# EAGLE design adapter_v1.2 (EAGLE 9.3.2)
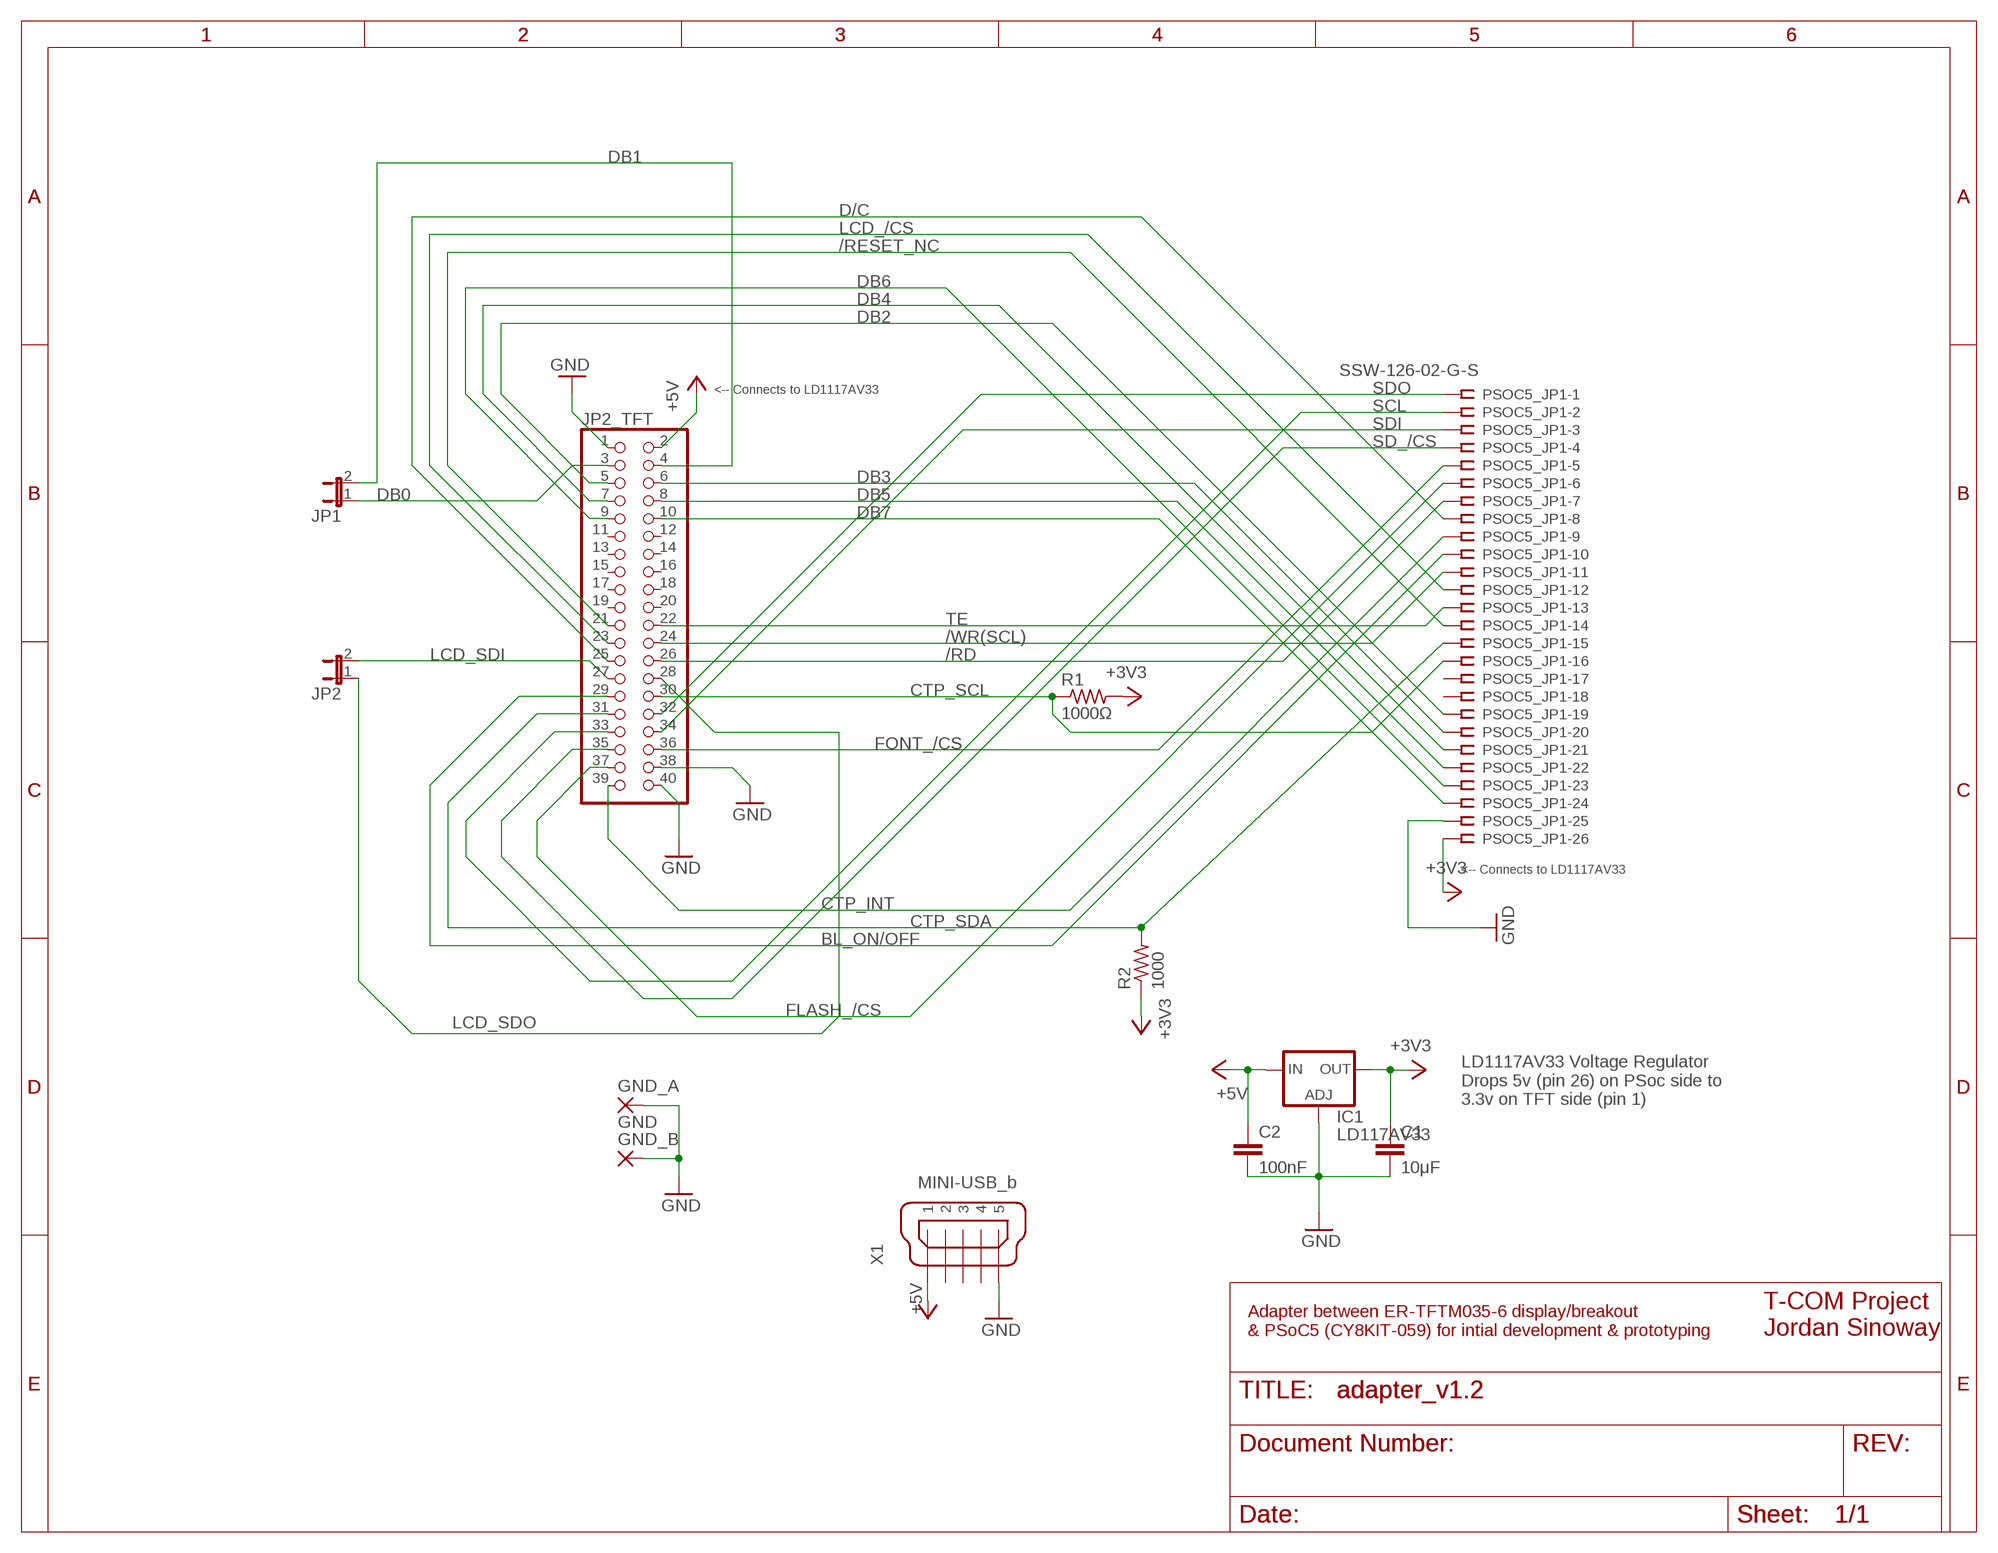
[diagram p0: schematic, sheet 1]

## Parts
C1  10μF  C2.5/2  [C2.5-2]
C2  100nF  C2.5/2  [C2.5-2]
GND_A  GND  SMD5  [SMD2,54-5,08]
GND_B  SMD5  [SMD2,54-5,08]
IC1  LD117AV33  [TO220L1]
JP1  JP1E  [JP1]
JP2  JP1E  [JP1]
JP2_TFT  PINHD-2X20  [2X20]
PSOC5_JP1  SSW-126-02-G-S  [SSW-126-02-G-S]
R1  1000Ω  R-US_0204/7  [0204/7]
R2  1000  R-US_0204/7  [0204/7]
X1  MINI-USB_b  MINI-USB_SHIELD5P2-32005-601  [32005-601]

## Nets
+3V3 [GND/voltage]: C1.1 IC1.2(OUT) PSOC5_JP1.26 R1.2 R2.1
+5V [GND/voltage]: C2.1 IC1.3(IN) JP2_TFT.2 X1.1
/RD: JP2_TFT.26 PSOC5_JP1.7
/RESET_NC: JP2_TFT.21 PSOC5_JP1.14
/WR(SCL): JP2_TFT.24 PSOC5_JP1.11
BL_ON/OFF: JP2_TFT.29 PSOC5_JP1.10
CTP_INT: JP2_TFT.39 PSOC5_JP1.9
CTP_SCL: JP2_TFT.30 PSOC5_JP1.16 R1.1
CTP_SDA: JP2_TFT.31 PSOC5_JP1.15 R2.2
D/C: JP2_TFT.25 PSOC5_JP1.8
DB0: JP1.1 JP2_TFT.3
DB1: JP1.2 JP2_TFT.4
DB2: JP2_TFT.5 PSOC5_JP1.19
DB3: JP2_TFT.6 PSOC5_JP1.20
DB4: JP2_TFT.7 PSOC5_JP1.21
DB5: JP2_TFT.8 PSOC5_JP1.22
DB6: JP2_TFT.9 PSOC5_JP1.23
DB7: JP2_TFT.10 PSOC5_JP1.24
FLASH_/CS: JP2_TFT.37 PSOC5_JP1.6
FONT_/CS: JP2_TFT.36 PSOC5_JP1.5
GND [GND/voltage]: C1.2 C2.2 GND_A.1(P) GND_B.1(P) IC1.1(ADJ) JP2_TFT.1 JP2_TFT.38 JP2_TFT.40 PSOC5_JP1.25 X1.5
LCD_/CS: JP2_TFT.23 PSOC5_JP1.12
LCD_SDI: JP2.2 JP2_TFT.27
LCD_SDO: JP2.1 JP2_TFT.28
SCL: JP2_TFT.33 PSOC5_JP1.2
SD_/CS: JP2_TFT.35 PSOC5_JP1.4
SDI: JP2_TFT.34 PSOC5_JP1.3
SDO: JP2_TFT.32 PSOC5_JP1.1
TE: JP2_TFT.22 PSOC5_JP1.13
Unconnected: JP2_TFT.11 JP2_TFT.12 JP2_TFT.13 JP2_TFT.14 JP2_TFT.15 JP2_TFT.16 JP2_TFT.17 JP2_TFT.18 JP2_TFT.19 JP2_TFT.20 PSOC5_JP1.17 PSOC5_JP1.18 X1.2 X1.3 X1.4 X1.M1(S1) X1.M2(S2)

## Notes on the sheet
- <-- Connects to LD1117AV33
- <-- Connects to LD1117AV33
- LD1117AV33 Voltage Regulator
  Drops 5v (pin 26) on PSoc side to
  3.3v on TFT side (pin 1)
- Adapter between ER-TFTM035-6 display/breakout 
  & PSoC5 (CY8KIT-059) for intial development & prototyping
- T-COM Project
  Jordan Sinoway

## Library data of the parts
C1 C2 = capacitor-wima:C: CAPACITOR naming: grid - package width
GND_A GND_B = wirepad:SMD5: SMD PAD
IC1 = v-reg:LD117A?*: Low drop fixed and adjustable positive voltage regulators 1 A Source: http://www.st.com/stonline/products/literature/ds/7194/ld1117axx.pdf
JP1 JP2 = jumper:JP1E: JUMPER
JP2_TFT = pinhead:PINHD-2X20: PIN HEADER
PSOC5_JP1 = con-samtec:SSW-126-02-G-S: THROUGH-HOLE .025" SQ POST SOCKET Source: Samtec SSW.pdf; MF: Samtec Inc.; MPN: SSW-126-02-G-S; OC_FARNELL: unknown; OC_NEWARK: 11P9742
R1 R2 = rcl:R-US_: RESISTOR, American symbol; SPICEPREFIX: R
X1 = con-cypressindustries:MINI-USB_SHIELD5P2-: MINI USB-B R/A DIP 5pol. Source: www.cypressindustries.com; OC_FARNELL: unknown; OC_NEWARK: unknown

## Net classes
0 default: clearance 0.102 mm
1 GND/voltage: width 0.457 mm, drill 0.152 mm, clearance 0.152 mm

## Board
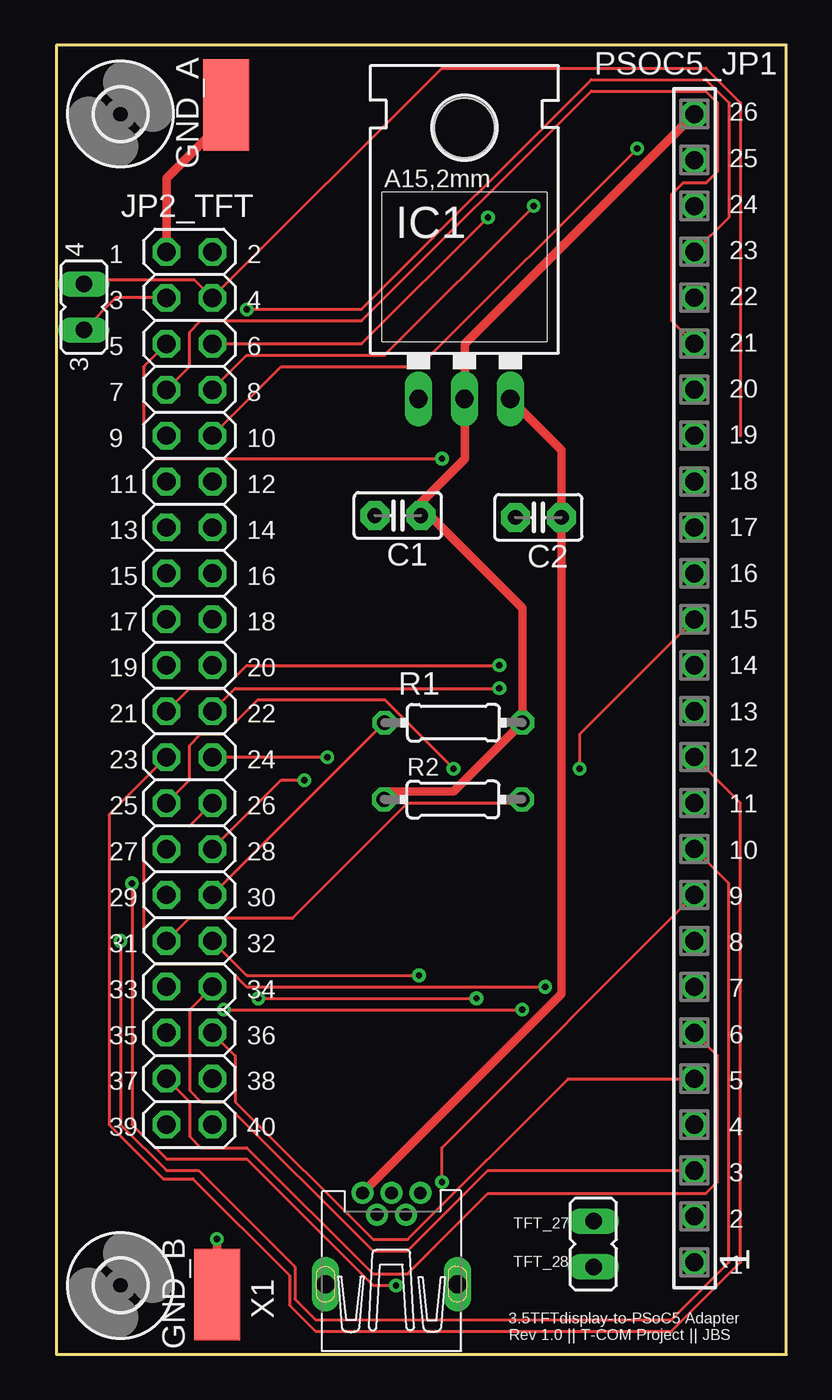
[diagram p1: board, top side]
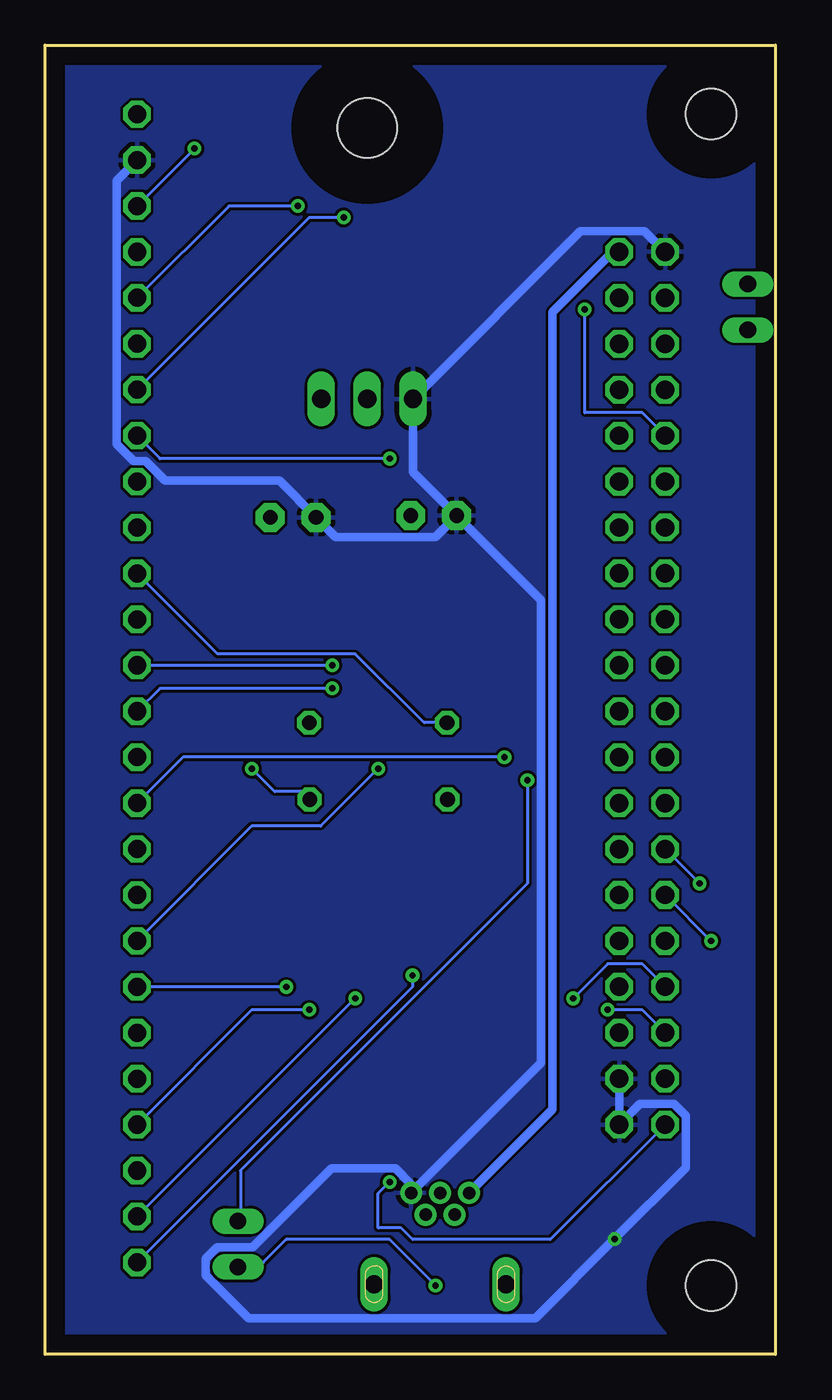
[diagram p2: board, bottom side, seen from below]

Size 40.39 x 72.39 mm. Coordinates in mm from the lower left corner, seen from the top.
Outline: 0,0 40.39,0 40.39,72.39 0,72.39 0,0
Copper layers (1*16): Top 0.035mm / dielectric 1.5mm / Bottom 0.035mm
Design rules "default": minimum track width 6mil, minimum drill 0.35mm, track to track 6mil, track to pad 6mil, pad to pad 6mil, via to via 6mil, smd to smd 6mil, copper to edge 40mil, drill to drill 6mil, minimum pad ring 10mil, minimum via ring 8mil, stop-mask expansion 4mil, vias tented up to drill 0mil, thermal gap 10mil

### Footprints (pad centres in the part's own frame; a part is rotated, then mirrored left to right if it is on the bottom)
C2.5-2 = drill 0.813 pad 1.6 octagon: 1 -1.27,0; 2 1.27,0
SMD2,54-5,08 = smd 2.54 x 5.08: 1 0,0
TO220L1 = drill 1.016 long: 1 -2.54,-3.81; 2 0,-3.81; 3 2.54,-3.81 | hole 3.302: 0,11.176
JP1 = drill 0.914 long: 1 0,-1.27; 2 0,1.27
2X20 = drill 1.016 octagon: 1 -24.13,-1.27; 2 -24.13,1.27; 3 -21.59,-1.27; 4 -21.59,1.27; 5 -19.05,-1.27; 6 -19.05,1.27; 7 -16.51,-1.27; 8 -16.51,1.27; 9 -13.97,-1.27; 10 -13.97,1.27; 11 -11.43,-1.27; 12 -11.43,1.27; 13 -8.89,-1.27; 14 -8.89,1.27; 15 -6.35,-1.27; 16 -6.35,1.27; 17 -3.81,-1.27; 18 -3.81,1.27; 19 -1.27,-1.27; 20 -1.27,1.27; 21 1.27,-1.27; 22 1.27,1.27; 23 3.81,-1.27; 24 3.81,1.27; 25 6.35,-1.27; 26 6.35,1.27; 27 8.89,-1.27; 28 8.89,1.27; 29 11.43,-1.27; 30 11.43,1.27; 31 13.97,-1.27; 32 13.97,1.27; 33 16.51,-1.27; 34 16.51,1.27; 35 19.05,-1.27; 36 19.05,1.27; 37 21.59,-1.27; 38 21.59,1.27; 39 24.13,-1.27; 40 24.13,1.27
SSW-126-02-G-S = drill 1 pad 1.5 octagon: 1 -31.75,0; 2 -29.21,0; 3 -26.67,0; 4 -24.13,0; 5 -21.59,0; 6 -19.05,0; 7 -16.51,0; 8 -13.97,0; 9 -11.43,0; 10 -8.89,0; 11 -6.35,0; 12 -3.81,0; 13 -1.27,0; 14 1.27,0; 15 3.81,0; 16 6.35,0; 17 8.89,0; 18 11.43,0; 19 13.97,0; 20 16.51,0; 21 19.05,0; 22 21.59,0; 23 24.13,0; 24 26.67,0; 25 29.21,0; 26 31.75,0
0204/7 = drill 0.813 octagon: 1 -3.81,0; 2 3.81,0
2,8 = hole 2.8: 0,0
32005-601 = drill 0.7 pad 1.016: 1 2.825,1.6; 2 1.625,0.8; 3 2.825,0; 4 1.625,-0.8; 5 2.825,-1.6 | drill 1 pad 1.422 long: M1 -2.225,3.65; M2 -2.225,-3.65

### Placement (x,y rotation side)
C1  18.9,46.38 180 top
C2  26.67,46.28 180 top
GND_A  9.4,69.09 0 top
GND_B  8.89,3.3 0 top
IC1  22.58,56.64 0 top
JP1  1.52,57.91 0 top
JP2  29.72,6.1 180 top
JP2_TFT  7.37,36.83 270 top
PSOC5_JP1  35.31,36.83 90 top
R1  21.97,34.92 0 top
R2  21.95,30.68 0 top
U$1  [2,8]  3.56,68.58 0 top
U$2  [2,8]  3.56,3.81 0 top
X1  18.54,6.1 90 top

### Tracks (layer width: path | path; a pad name or v marks a point on that pad's centre or on a via)
+3V3
  Top 0.457: R2.1 18.16,31.11 21.97,31.11 R1.2 25.78,41.27 20.7,46.35 C1.1 20.07,46.99 22.61,49.53 22.61,52.7 IC1.2 22.61,53.34 22.61,55.88 PSOC5_JP1.26
+5V
  Top 0.457: X1.1 27.94,19.92 C2.1 27.94,50.01 IC1.3
  Bottom 0.457: X1.1 12.32,13.54 12.32,57.62 8.98,60.96 JP2_TFT.2
/RD  (via drill 0.35)
  Top 0.152: v27.05,20.32 10.54,20.32 9.27,21.59 5.46,21.59 4.83,22.23 4.83,28.57 5.46,29.21 7.37,29.21 JP2_TFT.26
  Bottom 0.152: v27.05,20.32 PSOC5_JP1.7
/RESET_NC  (via drill 0.35)
  Top 0.152: v24.51,38.1 10.54,38.1 9.27,36.83 7.37,36.83 JP2_TFT.21
  Bottom 0.152: v24.51,38.1 PSOC5_JP1.14
/WR(SCL)  (via drill 0.35)
  Top 0.152: JP2_TFT.24 v14.99,33.02
  Bottom 0.152: PSOC5_JP1.11 32.77,33.02 v14.99,33.02
BL_ON/OFF  (via drill 0.35)
  Top 0.152: PSOC5_JP1.10 37.21,26.04 37.21,5.08 34.04,1.9 14.35,1.9 13.21,3.05 13.21,4.83 7.87,10.16 6.1,10.16 3.56,12.7 v3.56,22.86
  Bottom 0.152: JP2_TFT.29 v3.56,22.86
CTP_INT  (via drill 0.35)
  Top 0.152: PSOC5_JP1.9 21.34,11.43 v21.34,9.53
  Bottom 0.152: v21.34,9.53 21.97,8.89 21.97,6.99 20.7,6.99 20.07,6.35 12.45,6.35 JP2_TFT.39
CTP_SCL
  Top 0.152: JP2_TFT.30 R1.1
  Bottom 0.152: PSOC5_JP1.16 30.86,38.73 23.24,38.73 19.43,34.92 R1.1
CTP_SDA  (via drill 0.35)
  Top 0.152: JP2_TFT.31 7.37,24.13 13.08,24.13 19.43,30.48 25.15,30.48 R2.2 | PSOC5_JP1.15 28.96,34.29 v28.96,32.38
  Bottom 0.152: v28.96,32.38 27.69,31.11 25.78,31.11 R2.2
D/C  (via drill 0.35)
  Top 0.152: v21.97,32.38 18.16,36.2 11.18,36.2 9.27,34.29 8,34.29 7.37,33.65 7.37,31.75 JP2_TFT.25
  Bottom 0.152: PSOC5_JP1.8 28.96,29.21 25.15,29.21 v21.97,32.38
DB0
  Top 0.152: JP2_TFT.3 3.3,58.42 JP1.1
DB1
  Top 0.152: 37.85,50.8 37.85,69.22 35.94,71.12 21.34,71.12 JP2_TFT.4 7.64,59.41 1.75,59.41 JP1.2
DB2  (via drill 0.35)
  Top 0.152: v21.34,49.53 5.46,49.53 4.83,50.16 4.83,54.61 JP2_TFT.5
  Bottom 0.152: PSOC5_JP1.19 34.04,49.53 v21.34,49.53
DB3  (via drill 0.35)
  Top 0.152: v23.88,62.87 16.89,55.88 JP2_TFT.6
  Bottom 0.152: PSOC5_JP1.20 25.78,62.87 v23.88,62.87
DB4
  Top 0.152: PSOC5_JP1.21 34.04,57.15 34.04,64.14 34.67,64.77 35.94,64.77 36.58,65.41 36.58,69.22 35.94,69.85 29.59,69.85 16.89,57.15 8,57.15 7.37,56.51 7.37,54.61 JP2_TFT.7
DB5  (via drill 0.35)
  Top 0.152: v26.42,63.5 18.16,55.24 10.54,55.24 JP2_TFT.8
  Bottom 0.152: PSOC5_JP1.22 30.23,63.5 v26.42,63.5
DB6  (via drill 0.35)
  Top 0.152: PSOC5_JP1.23 37.21,62.87 37.21,69.22 35.94,70.48 29.59,70.48 16.89,57.78 v10.54,57.78
  Bottom 0.152: v10.54,57.78 10.54,52.07 7.37,52.07 JP2_TFT.9
DB7  (via drill 0.35)
  Top 0.152: v32.13,66.67 20.07,54.61 12.45,54.61 JP2_TFT.10
  Bottom 0.152: v32.13,66.67 PSOC5_JP1.24
FLASH_/CS
  Top 0.152: PSOC5_JP1.6 36.58,16.51 36.58,9.53 35.94,8.89 23.88,8.89 19.43,4.45 17.53,4.45 10.54,11.43 8,11.43 7.37,12.07 7.37,13.97 JP2_TFT.37
FONT_/CS
  Top 0.152: PSOC5_JP1.5 28.32,15.24 19.43,6.35 17.53,6.35 9.91,13.97 9.91,16.51 JP2_TFT.36
GND  (via drill 0.35)
  Top 0.457: GND_A.1 9.4,68.33 6.1,65.02 JP2_TFT.1 | GND_B.1 v8.89,6.37
  Bottom 0.457: C1.2 20.04,48.79 IC1.1 10.77,62.1 7.24,62.1 JP2_TFT.1 | JP2_TFT.38 JP2_TFT.40 7.49,13.84 5.62,13.84 4.95,13.17 4.95,10.31 v8.89,6.37 13.28,1.98 29.13,1.98 31.52,4.37 31.52,5.28 30.88,5.92 28.91,5.92 24.54,10.28 21.02,10.28 20.14,9.41 X1.5 12.96,16.11 12.96,41.71 C1.2 | C1.2 18.81,45.2 24.32,45.2 C2.2 27.43,48.3 33.75,48.3 34.84,49.39 35.51,49.39 36.44,50.33 36.44,64.91 PSOC5_JP1.25
  pour Bottom: 46.74,77.47 46.74,-3.81 -5.33,-3.81 -5.33,77.47
LCD_/CS
  Top 0.152: PSOC5_JP1.12 37.85,30.48 37.85,5.08 34.04,1.27 14.35,1.27 12.9,2.72 12.9,4.37 7.56,9.72 5.91,9.72 2.92,12.7 2.92,29.84 JP2_TFT.23
LCD_SDI  (via drill 0.35)
  Top 0.152: v18.8,3.81 17.53,3.81 10.54,10.79 6.1,10.79 4.19,12.7 v4.19,26.04
  Bottom 0.152: v18.8,3.81 21.34,6.35 27.05,6.35 28.32,5.08 29.59,5.08 JP2.2 | JP2_TFT.27 v4.19,26.04
LCD_SDO  (via drill 0.35)
  Top 0.152: v13.72,31.75 12.45,31.75 JP2_TFT.28
  Bottom 0.152: v13.72,31.75 13.72,26.04 29.59,10.16 29.59,7.62 JP2.1
SCL  (via drill 0.35)
  Top 0.152: v11.18,19.68 v23.24,19.68
  Bottom 0.152: v23.24,19.68 PSOC5_JP1.2 | v11.18,19.68 9.27,21.59 7.37,21.59 JP2_TFT.33
SD_/CS  (via drill 0.35)
  Top 0.152: v9.27,19.05 v25.78,19.05
  Bottom 0.152: PSOC5_JP1.4 28.96,19.05 v25.78,19.05 | v9.27,19.05 7.37,19.05 JP2_TFT.35
SDI
  Top 0.152: PSOC5_JP1.3 23.88,10.16 19.43,5.71 17.53,5.71 9.27,13.97 8,13.97 7.37,14.61 7.37,19.05 JP2_TFT.34
SDO  (via drill 0.35)
  Top 0.152: v20.07,20.96 10.54,20.96 JP2_TFT.32
  Bottom 0.152: PSOC5_JP1.1 20.07,20.32 v20.07,20.96
TE  (via drill 0.35)
  Top 0.152: v24.51,36.83 9.91,36.83 JP2_TFT.22
  Bottom 0.152: PSOC5_JP1.13 34.04,36.83 v24.51,36.83

### Text on the board
tNames: 4 | 3 | 1 / 3 / 5 / 7 / 9 / 11 / 13 / 15 / 17 / 19 / 21 / 23 / 25 / 27 / 29 / 31 / 33 / 35 / 37 / 39 | 2 / 4 / 6 / 8 / 10 / 12 / 14 / 16 / 18 / 20 / 22 / 24 / 26 / 28 / 30 / 32 / 34 / 36 / 38 / 40 | TFT_27 / TFT_28 | 26 / 25 / 24 / 23 / 22 / 21 / 20 / 19 / 18 / 17 / 16 / 15 / 14 / 13 / 12 / 11 / 10 / 9 / 8 / 7 / 6 / 5 / 4 / 3 / 2 / 1 | 3.5TFTdisplay-to-PSoC5 Adapter / Rev 1.0 || T-COM Project || JBS